# EAGLE design PQ60 EPS FV2 (EAGLE 7.4.0)
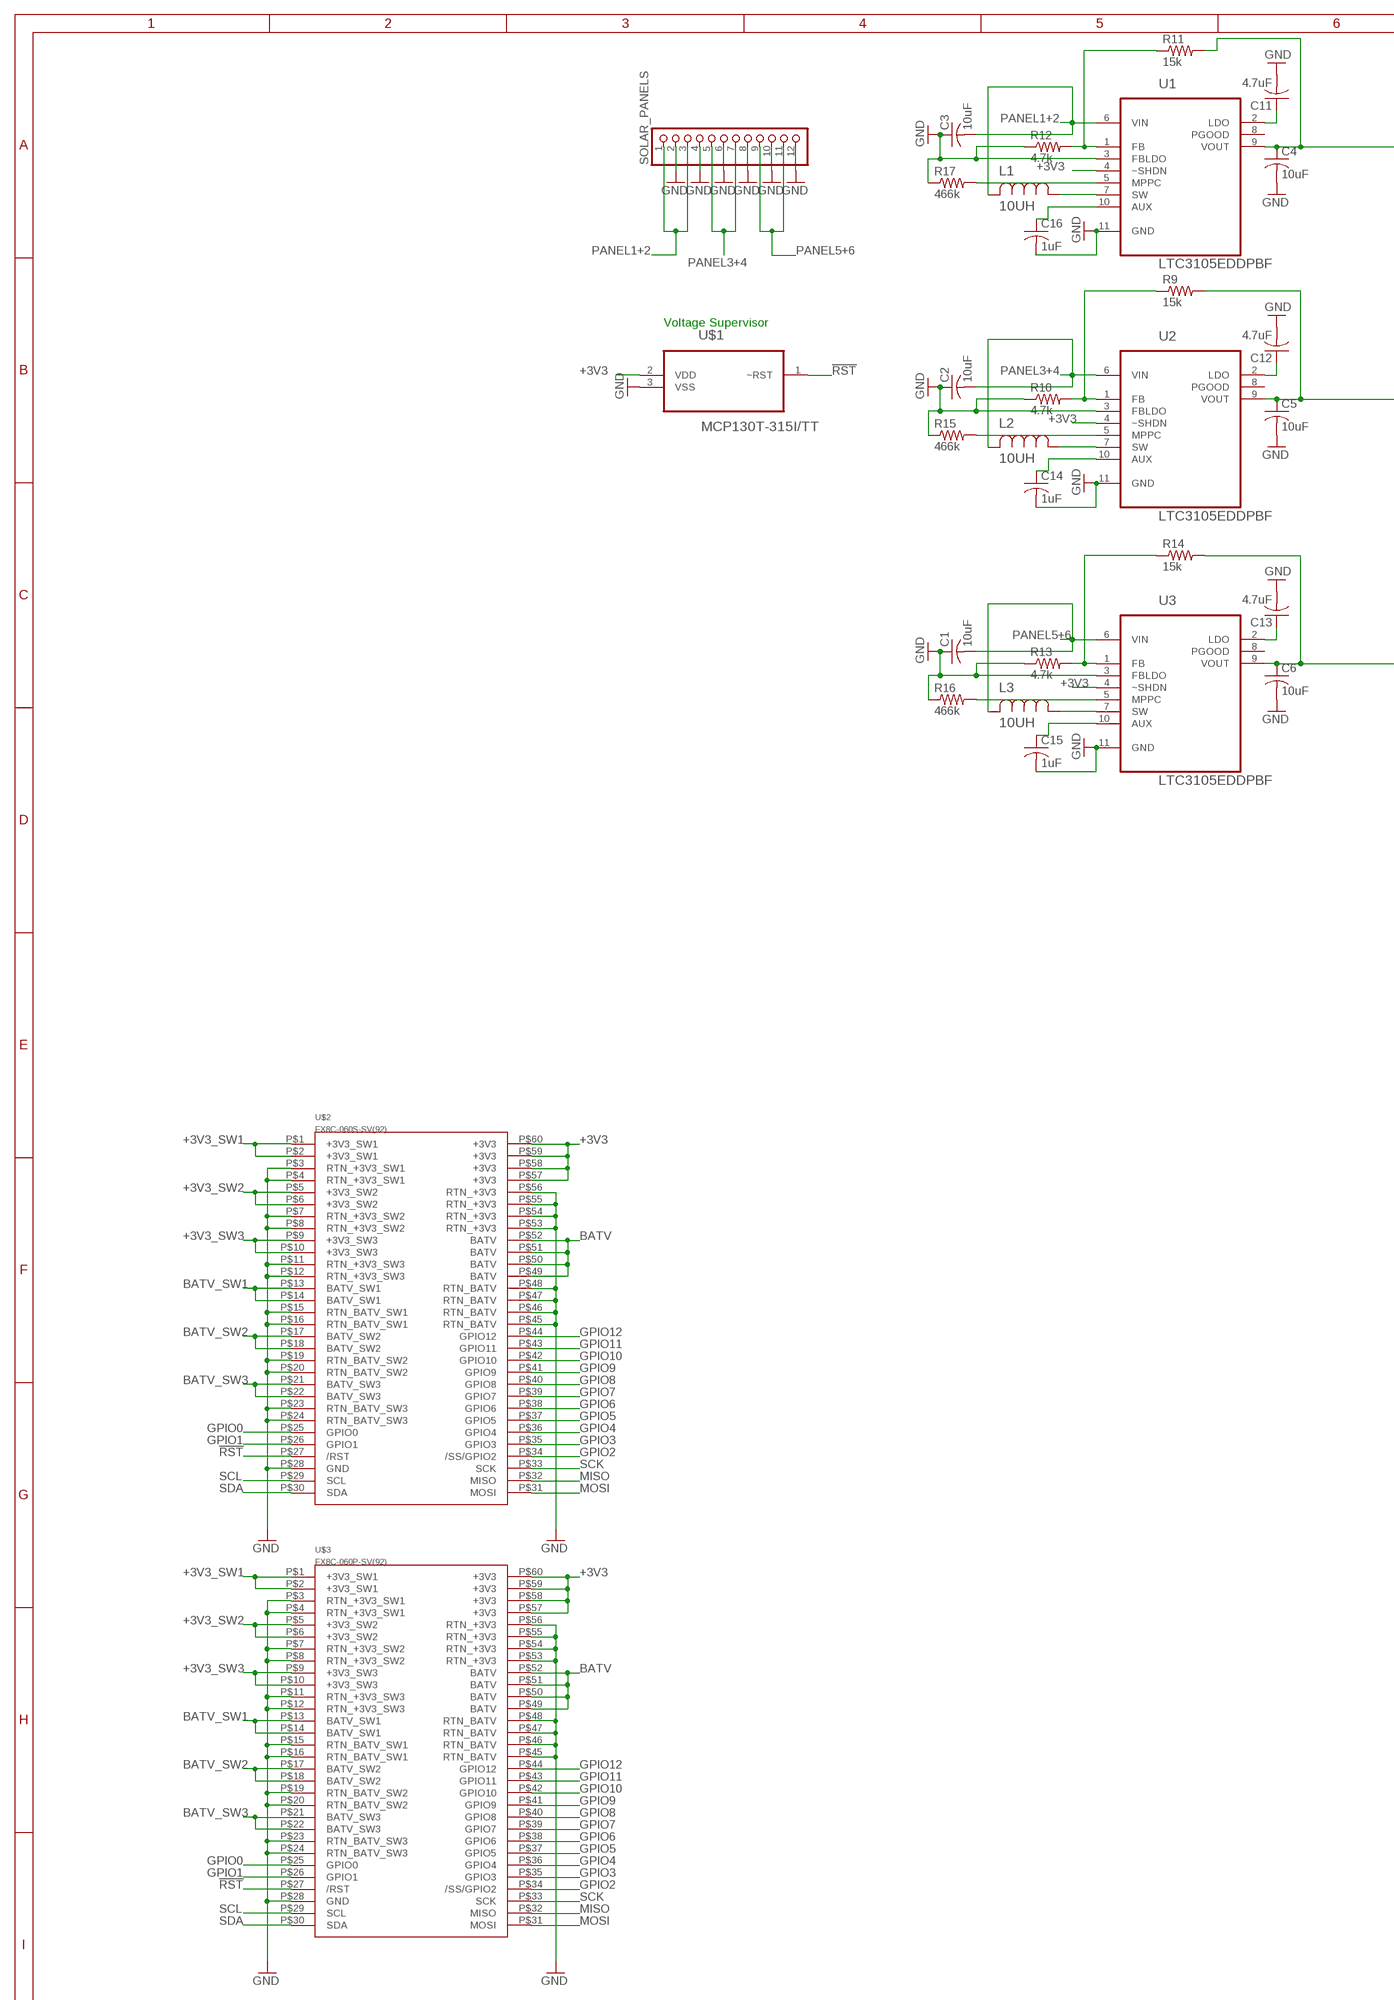
[diagram p0: schematic, sheet 1, part 1 of 2]
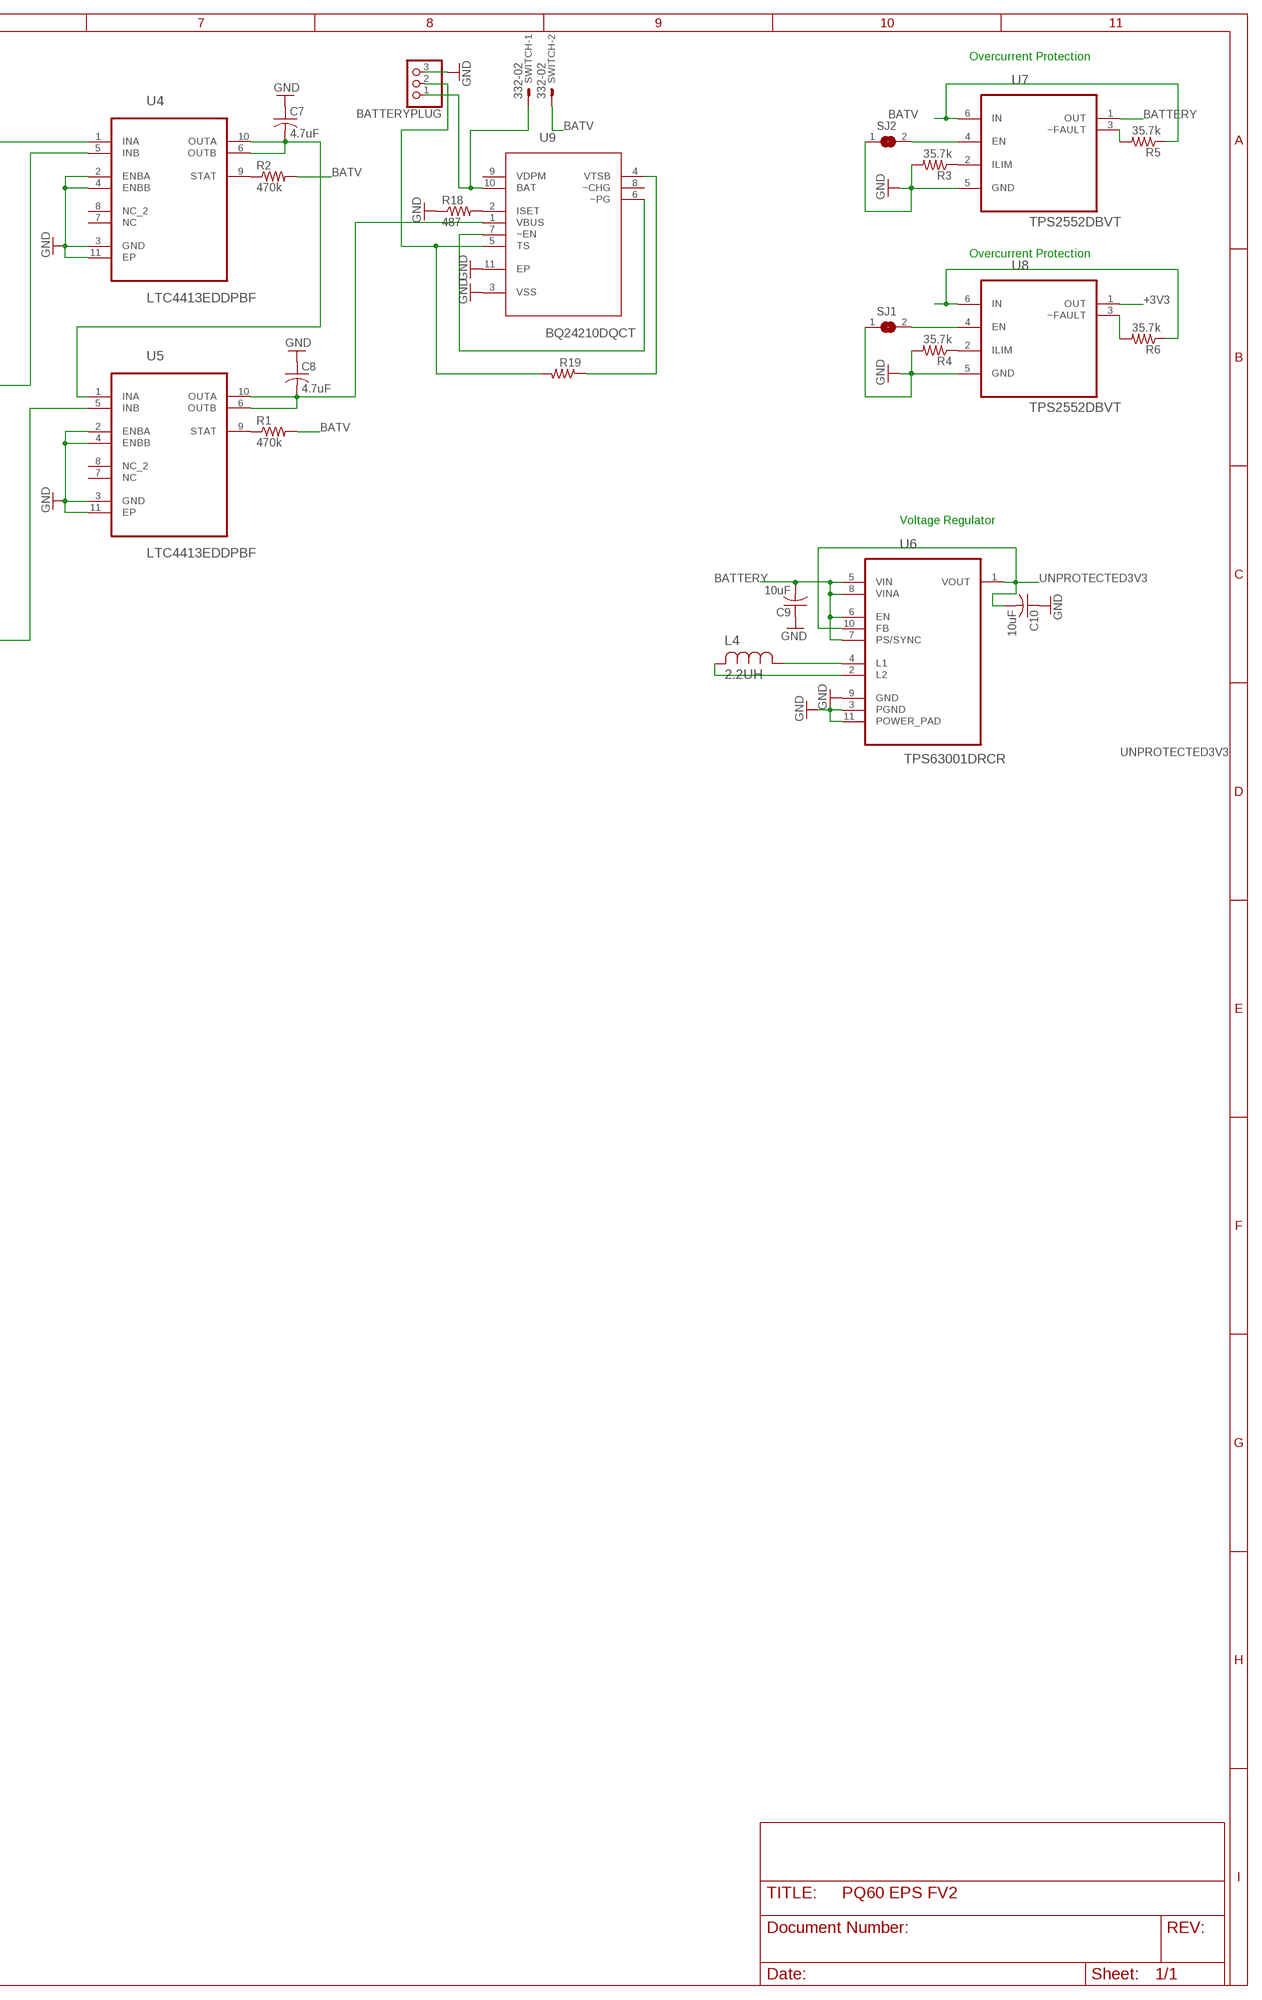
[diagram p1: schematic, sheet 1, part 2 of 2]

## Parts
BATTERYPLUG  PINHD-1X3  [1X03]
C1  10uF  C-USC0805  [C0805]
C2  10uF  C-USC0805  [C0805]
C3  10uF  C-USC0805  [C0805]
C4  10uF  C-USC0805  [C0805]
C5  10uF  C-USC0805  [C0805]
C6  10uF  C-USC0805  [C0805]
C7  4.7uF  C-USC0805  [C0805]
C8  4.7uF  C-USC0805  [C0805]
C9  10uF  C-USC0805  [C0805]
C10  10uF  C-USC0805  [C0805]
C11  4.7uF  C-USC0805  [C0805]
C12  4.7uF  C-USC0805  [C0805]
C13  4.7uF  C-USC0805  [C0805]
C14  1uF  C-USC0805  [C0805]
C15  1uF  C-USC0805  [C0805]
C16  1uF  C-USC0805  [C0805]
L1  10UH  ELL6SH100M-6XH  [IND_ELL6XH]
L2  10UH  ELL6SH100M-6XH  [IND_ELL6XH]
L3  10UH  ELL6SH100M-6XH  [IND_ELL6XH]
L4  2.2UH  ELL3FU2R2N-3FU  [IND_ELL3FU]
R1  470k  R-US_R0805  [R0805]
R2  470k  R-US_R0805  [R0805]
R3  35.7k  R-US_R0805  [R0805]
R4  35.7k  R-US_R0805  [R0805]
R5  35.7k  R-US_R0805  [R0805]
R6  35.7k  R-US_R0805  [R0805]
R9  15k  R-US_R0805  [R0805]
R10  4.7k  R-US_R0805  [R0805]
R11  15k  R-US_R0805  [R0805]
R12  4.7k  R-US_R0805  [R0805]
R13  4.7k  R-US_R0805  [R0805]
R14  15k  R-US_R0805  [R0805]
R15  466k  R-US_R0805  [R0805]
R16  466k  R-US_R0805  [R0805]
R17  466k  R-US_R0805  [R0805]
R18  487  R-US_R0805  [R0805]
R19  R-US_R0805  [R0805]
SJ1  SJ  [SJ]
SJ2  SJ  [SJ]
SOLAR_PANELS  PINHD-1X12-CB  [1X12-CB]
SWITCH  332-02  [332-02]
U1  LTC3105EDDPBF  [DFN300X300X80-11N]
U2  LTC3105EDDPBF  [DFN300X300X80-11N]
U3  LTC3105EDDPBF  [DFN300X300X80-11N]
U4  LTC4413EDDPBF  [DFN300X300X80-11N]
U5  LTC4413EDDPBF  [DFN300X300X80-11N]
U6  TPS63001DRCR  [SON50P300X300X100-11N]
U7  TPS2552DBVT  [SOT95P280X145-6N]
U8  TPS2552DBVT  [SOT95P280X145-6N]
U9  BQ24210DQCT  [SON50P200X300X80-11N]
U$1  MCP130T-315I/TT  [SOT95P237X112-3N]
U$2  FX8C-060S-SV(92)  [FX8C-060S-SV(92)]
U$3  FX8C-060P-SV(92)  [FX8C-060P-SV(92)]

## Nets
!RST: U$1.1(~RST) U$2.P$27(/RST) U$3.P$27(/RST)
+3V3: U1.4(~SHDN) U2.4(~SHDN) U3.4(~SHDN) U8.1(OUT) U$1.2(VDD) U$2.P$57(+3V3) U$2.P$58(+3V3) U$2.P$59(+3V3) U$2.P$60(+3V3) U$3.P$57(+3V3) U$3.P$58(+3V3) U$3.P$59(+3V3) U$3.P$60(+3V3)
+3V3_SW1: U$2.P$1(+3V3_SW1) U$2.P$2(+3V3_SW1) U$3.P$1(+3V3_SW1) U$3.P$2(+3V3_SW1)
+3V3_SW2: U$2.P$5(+3V3_SW2) U$2.P$6(+3V3_SW2) U$3.P$5(+3V3_SW2) U$3.P$6(+3V3_SW2)
+3V3_SW3: U$2.P$9(+3V3_SW3) U$2.P$10(+3V3_SW3) U$3.P$9(+3V3_SW3) U$3.P$10(+3V3_SW3)
BATTERY: C9.2 U6.5(VIN) U6.6(EN) U6.7(PS/SYNC) U6.8(VINA) U7.1(OUT)
BATV: R1.2 R2.2 R5.1 SWITCH.2 U7.6(IN) U$2.P$49(BATV) U$2.P$50(BATV) U$2.P$51(BATV) U$2.P$52(BATV) U$3.P$49(BATV) U$3.P$50(BATV) U$3.P$51(BATV) U$3.P$52(BATV)
BATV_SW1: U$2.P$13(BATV_SW1) U$2.P$14(BATV_SW1) U$3.P$13(BATV_SW1) U$3.P$14(BATV_SW1)
BATV_SW2: U$2.P$17(BATV_SW2) U$2.P$18(BATV_SW2) U$3.P$17(BATV_SW2) U$3.P$18(BATV_SW2)
BATV_SW3: U$2.P$21(BATV_SW3) U$2.P$22(BATV_SW3) U$3.P$21(BATV_SW3) U$3.P$22(BATV_SW3)
GND: BATTERYPLUG.3 C1.1 C2.1 C3.1 C4.2 C5.2 C6.2 C7.1 C8.1 C9.1 C10.1 C11.2 C12.2 C13.2 C14.2 C15.2 C16.2 R3.2 R4.2 R10.1 R12.1 R13.1 R15.1 R16.1 R17.1 R18.1 SJ1.1 SJ2.1 SOLAR_PANELS.2 SOLAR_PANELS.4 SOLAR_PANELS.6 SOLAR_PANELS.8 SOLAR_PANELS.10 SOLAR_PANELS.12 U1.3(FBLDO) U1.11(GND) U2.3(FBLDO) U2.11(GND) U3.3(FBLDO) U3.11(GND) U4.2(ENBA) U4.3(GND) U4.4(ENBB) U4.11(EP) U5.2(ENBA) U5.3(GND) U5.4(ENBB) U5.11(EP) U6.3(PGND) U6.9(GND) U6.11(POWER_PAD) U7.5(GND) U8.5(GND) U9.3(VSS) U9.11(EP) U$1.3(VSS) U$2.P$3(RTN_+3V3_SW1) U$2.P$4(RTN_+3V3_SW1) U$2.P$7(RTN_+3V3_SW2) U$2.P$8(RTN_+3V3_SW2) U$2.P$11(RTN_+3V3_SW3) U$2.P$12(RTN_+3V3_SW3) U$2.P$15(RTN_BATV_SW1) U$2.P$16(RTN_BATV_SW1) U$2.P$19(RTN_BATV_SW2) U$2.P$20(RTN_BATV_SW2) U$2.P$23(RTN_BATV_SW3) U$2.P$24(RTN_BATV_SW3) U$2.P$28(GND) U$2.P$45(RTN_BATV) U$2.P$46(RTN_BATV) U$2.P$47(RTN_BATV) U$2.P$48(RTN_BATV) U$2.P$53(RTN_+3V3) U$2.P$54(RTN_+3V3) U$2.P$55(RTN_+3V3) U$2.P$56(RTN_+3V3) U$3.P$3(RTN_+3V3_SW1) U$3.P$4(RTN_+3V3_SW1) U$3.P$7(RTN_+3V3_SW2) U$3.P$8(RTN_+3V3_SW2) U$3.P$11(RTN_+3V3_SW3) U$3.P$12(RTN_+3V3_SW3) U$3.P$15(RTN_BATV_SW1) U$3.P$16(RTN_BATV_SW1) U$3.P$19(RTN_BATV_SW2) U$3.P$20(RTN_BATV_SW2) U$3.P$23(RTN_BATV_SW3) U$3.P$24(RTN_BATV_SW3) U$3.P$28(GND) U$3.P$45(RTN_BATV) U$3.P$46(RTN_BATV) U$3.P$47(RTN_BATV) U$3.P$48(RTN_BATV) U$3.P$53(RTN_+3V3) U$3.P$54(RTN_+3V3) U$3.P$55(RTN_+3V3) U$3.P$56(RTN_+3V3)
GPIO0: U$2.P$25(GPIO0) U$3.P$25(GPIO0)
GPIO1: U$2.P$26(GPIO1) U$3.P$26(GPIO1)
GPIO2: U$2.P$34(/SS/GPIO2) U$3.P$34(/SS/GPIO2)
GPIO3: U$2.P$35(GPIO3) U$3.P$35(GPIO3)
GPIO4: U$2.P$36(GPIO4) U$3.P$36(GPIO4)
GPIO5: U$2.P$37(GPIO5) U$3.P$37(GPIO5)
GPIO6: U$2.P$38(GPIO6) U$3.P$38(GPIO6)
GPIO7: U$2.P$39(GPIO7) U$3.P$39(GPIO7)
GPIO8: U$2.P$40(GPIO8) U$3.P$40(GPIO8)
GPIO9: U$2.P$41(GPIO9) U$3.P$41(GPIO9)
GPIO10: U$2.P$42(GPIO10) U$3.P$42(GPIO10)
GPIO11: U$2.P$43(GPIO11) U$3.P$43(GPIO11)
GPIO12: U$2.P$44(GPIO12) U$3.P$44(GPIO12)
MISO: U$2.P$32(MISO) U$3.P$32(MISO)
MOSI: U$2.P$31(MOSI) U$3.P$31(MOSI)
N$1: L2.1 U2.7(SW)
N$2: L3.1 U3.7(SW)
N$3: L1.1 U1.7(SW)
N$4: L4.1 U6.4(L1)
N$5: C4.1 R11.2 U1.9(VOUT) U4.1(INA)
N$6: C5.1 R9.2 U2.9(VOUT) U4.5(INB)
N$7: C6.1 R14.2 U3.9(VOUT) U5.5(INB)
N$8: R4.1 U8.2(ILIM)
N$9: C7.2 U4.6(OUTB) U4.10(OUTA) U5.1(INA)
N$10: R1.1 U5.9(STAT)
N$11: R2.1 U4.9(STAT)
N$12: L4.2 U6.2(L2)
N$13: R3.1 U7.2(ILIM)
N$14: R5.2 U7.3(~FAULT)
N$15: R6.2 U8.3(~FAULT)
N$16: SJ1.2 U8.4(EN)
N$17: SJ2.2 U7.4(EN)
N$18: R13.2 R14.1 U3.1(FB)
N$19: C11.1 U1.2(LDO)
N$20: C12.1 U2.2(LDO)
N$21: C13.1 U3.2(LDO)
N$22: C14.1 U2.10(AUX)
N$23: C15.1 U3.10(AUX)
N$24: C16.1 U1.10(AUX)
N$25: R11.1 R12.2 U1.1(FB)
N$26: R9.1 R10.2 U2.1(FB)
N$28: R15.2 U2.5(MPPC)
N$29: R16.2 U3.5(MPPC)
N$30: R17.2 U1.5(MPPC)
N$31: C8.2 U5.6(OUTB) U5.10(OUTA) U9.1(VBUS)
N$32: U9.6(~PG) U9.7(~EN)
N$33: R18.2 U9.2(ISET)
N$34: BATTERYPLUG.1 SWITCH.1 U9.10(BAT)
N$35: BATTERYPLUG.2 R19.2 U9.5(TS)
N$36: R19.1 U9.4(VTSB)
PANEL1+2: C3.2 L1.2 SOLAR_PANELS.1 SOLAR_PANELS.3 U1.6(VIN)
PANEL3+4: C2.2 L2.2 SOLAR_PANELS.5 SOLAR_PANELS.7 U2.6(VIN)
PANEL5+6: C1.2 L3.2 SOLAR_PANELS.9 SOLAR_PANELS.11 U3.6(VIN)
SCK: U$2.P$33(SCK) U$3.P$33(SCK)
SCL: U$2.P$29(SCL) U$3.P$29(SCL)
SDA: U$2.P$30(SDA) U$3.P$30(SDA)
UNPROTECTED3V3: C10.2 R6.1 U6.1(VOUT) U6.10(FB) U8.6(IN)
Unconnected: U1.8(PGOOD) U2.8(PGOOD) U3.8(PGOOD) U4.7(NC) U4.8(NC_2) U5.7(NC) U5.8(NC_2) U9.8(~CHG) U9.9(VDPM)

## Notes on the sheet
- Overcurrent Protection
- Overcurrent Protection
- Voltage Supervisor
- Voltage Regulator

## Library data of the parts
BATTERYPLUG = adafruit:PINHD-1X3: PIN HEADER
C1-C16 = adafruit:C-US: CAPACITOR, American symbol
L1-L3 = Panasonic-ELL:ELL: Choke Coils; MPN: ELL6SH100M; OC_FARNELL: 1539555; OC_NEWARK: 95M4201; PACKAGE: SMD; SUPPLIER: PANASONIC
L4 = Panasonic-ELL:ELL: Choke Coils; CURRENTRATING: 1.6A; MPN: ELL3FU2R2N; OC_FARNELL: 1888686; OC_NEWARK: 56T0899; PACKAGE: SMD-3FU; SUPPLIER: PANASONIC; TOLERANCE: ±30 %
R1-R6 R9-R19 = adafruit:R-US_: RESISTOR, American symbol
SJ1 SJ2 = jumper:SJ: SMD solder JUMPER
SOLAR_PANELS = adafruit:PINHD-1X12: PIN HEADER
SWITCH = con-garry:332-02: 2 Pin - 2mm Dual Row Source: www.mpe-connector.de / garry_shortform_2012.pdf
U1-U3 = LTC3105:LTC3105EDDPBF: 400mA Step-Up DC/DC Converter with Maximum Power Point Control and 250mV Start-Up; MPN: LTC3105EDD#PBF; OC_FARNELL: 1898600; OC_NEWARK: 27T5809; PACKAGE: DFN-10; SUPPLIER: Linear Technology
U4 U5 = LTC4413:LTC4413EDDPBF: Dual 2.6A, 2.5V to 5.5V, Ideal Diodes; MPN: LTC4413EDD#PBF; OC_FARNELL: 1663736; OC_NEWARK: 56M9529; PACKAGE: DFN-10; SUPPLIER: Linear Technology
U6 = TPS63001:TPS63001DRCR: HIGH EFFICIENT SINGLE INDUCTOR BUCK-BOOST CONVERTER WITH 1.8-A SWITCHES; MPN: TPS63001DRCR; OC_FARNELL: -; OC_NEWARK: 85K1711; PACKAGE: SON-10; SUPPLIER: TEXAS INSTRUMENTS
U7 U8 = TPS2552:TPS2552DBVT: PRECISION ADJUSTABLE CURRENT-LIMITED POWER-DISTRIBUTION SWITCHES; MPN: TPS2552DBVT; OC_FARNELL: 1694421; OC_NEWARK: 40P3866; PACKAGE: SOT-23-6; SUPPLIER: Texas Instruments
U9 = BQ24210:BQ24210DQCT: Single Cell Li-Ion Battery Solar Charger; MPN: BQ24210DQCT; OC_FARNELL: 1903633; OC_NEWARK: 56T0491; PACKAGE: SON-10; SUPPLIER: TEXAS INSTRUMENTS
U$1 = MCP130T:MCP130T-315I/TT: Microcontroller Supervisory Circuit; MPN: MCP130T-315I/TT; OC_FARNELL: 3021154; OC_NEWARK: 96K3703; PACKAGE: SOT-3; SUPPLIER: Microchip
U$2 = PQ60:FX8C-060S-SV(92)
U$3 = PQ60:FX8C-060P-SV(92)

## Net classes
0 default: clearance 0.205 mm

## Board
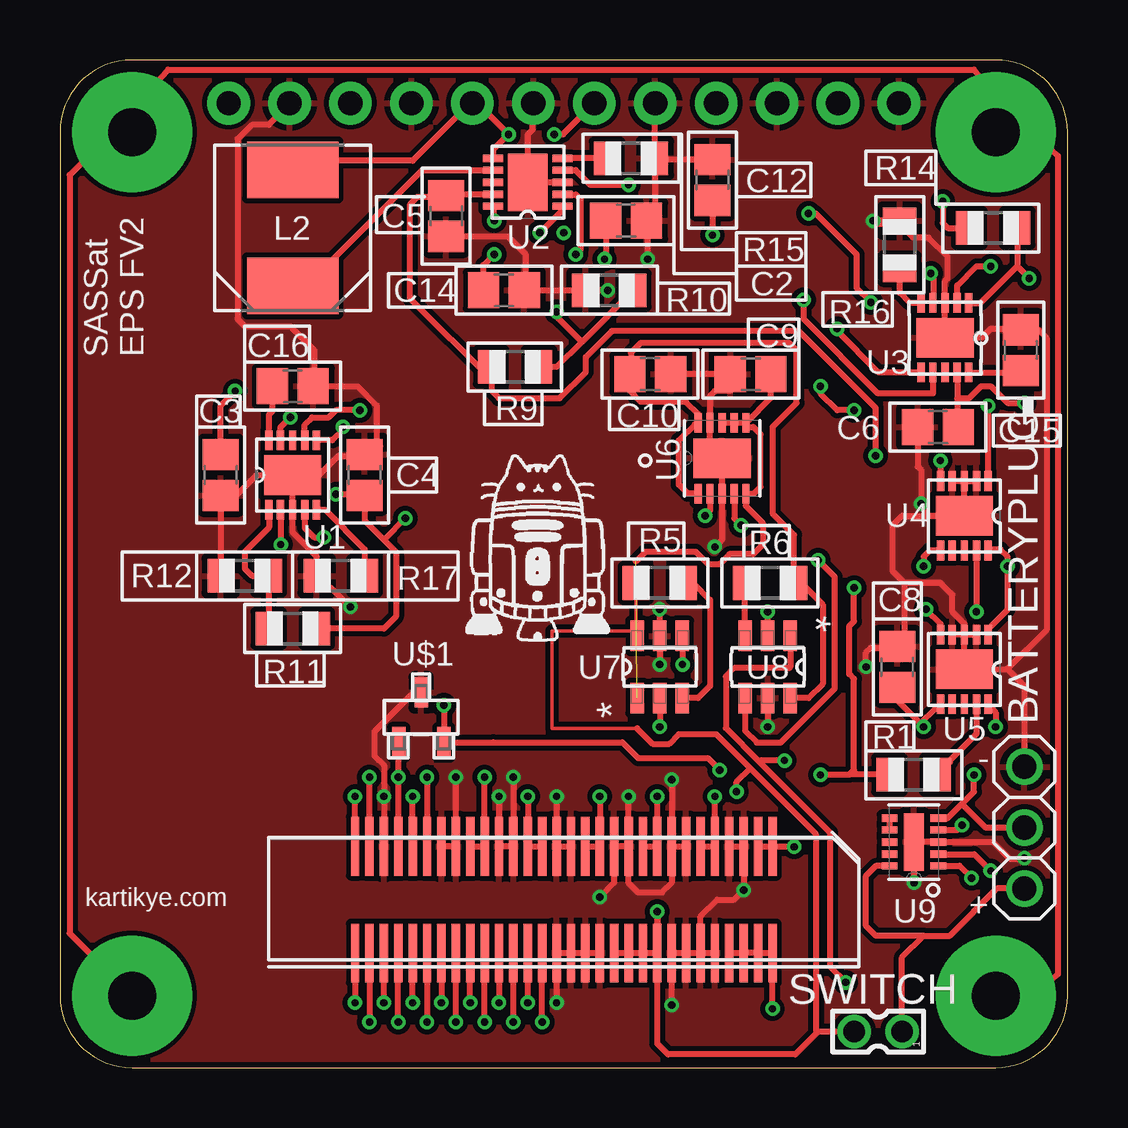
[diagram p2: board, top side]
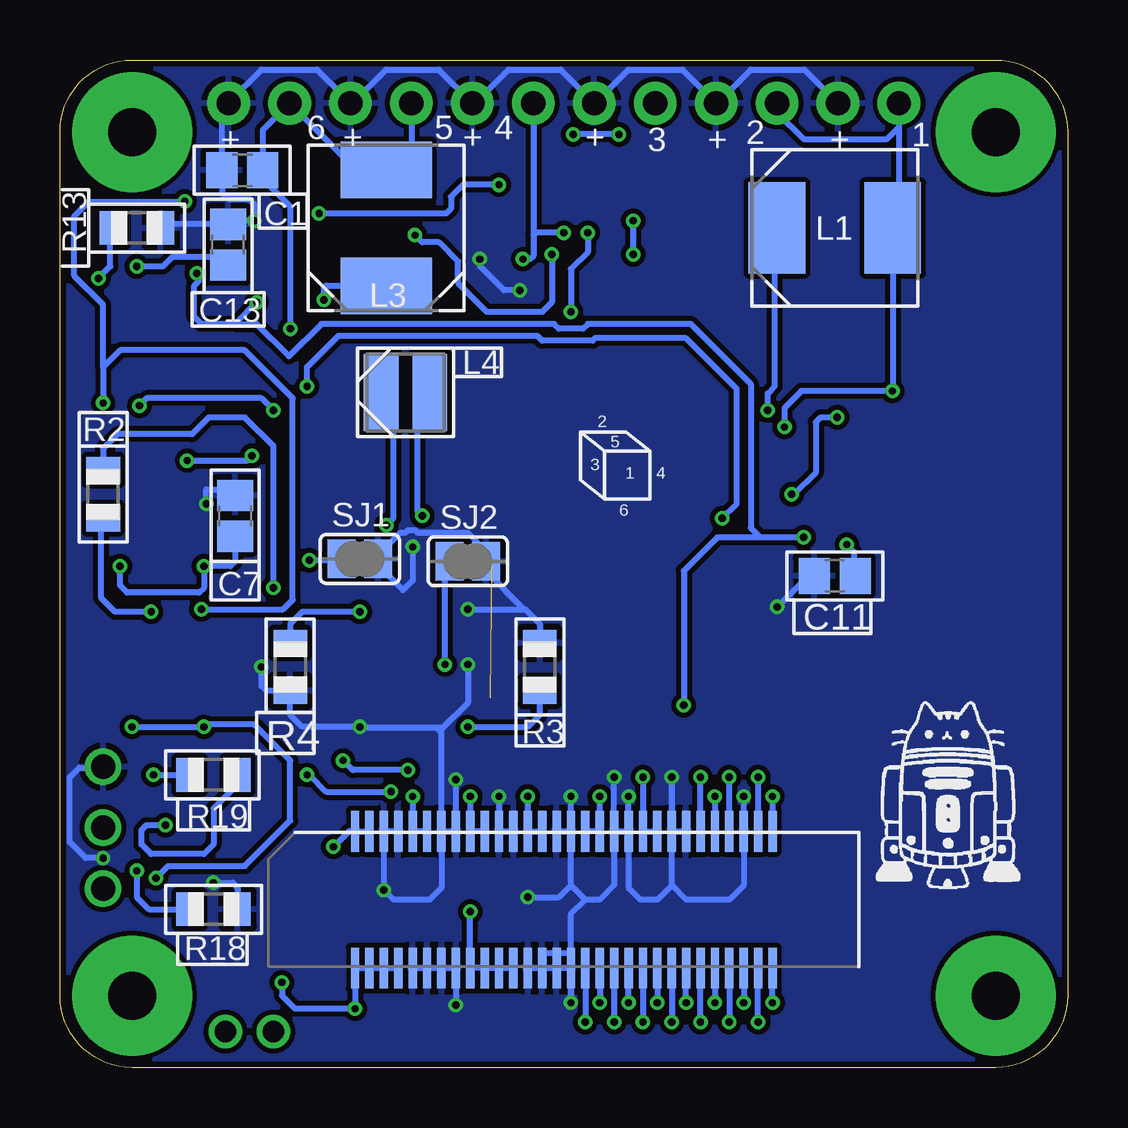
[diagram p3: board, bottom side, seen from below]

Size 42 x 42 mm. Coordinates in mm from the lower left corner, seen from the top.
Outline: 42,3 42,39 arc90 39,42 3,42 arc90 0,39 0,3 arc90 3,0 39,0 arc90 42,3
Copper layers (1*16): Top 0.035mm / dielectric 1.5mm / Bottom 0.035mm
Design rules "SeeedStudio_2layer_DRU_no_angle_20140221 *": minimum track width 6mil, minimum drill 0.3mm, track to track 6mil, track to pad 6mil, pad to pad 6mil, via to via 6mil, smd to smd 0mil, copper to edge 10mil, drill to drill 10mil, minimum pad ring 10mil, minimum via ring 6mil, stop-mask expansion 2mil, vias tented up to drill 100mil, thermal gap 10mil

### Footprints (pad centres in the part's own frame; a part is rotated, then mirrored left to right if it is on the bottom)
1X03 = drill 1.016: 1 -2.54,0; 2 0,0; 3 2.54,0
C0805 = smd 1.3 x 1.5: 1 -0.85,0; 2 0.85,0
IND_ELL6XH = smd 2.362 x 3.81: 1 -2.413,0; 2 2.413,0
IND_ELL3FU = smd 1.448 x 3.2: 1 -1.016,0; 2 1.016,0
R0805 = smd 1.1 x 1.4: 1 -1,0; 2 1,0
SJ = smd 1.168 x 1.6: 1 -0.762,0; 2 0.762,0
1X12-CB = drill 1.016 pad 1.778: 1 -13.97,0; 2 -11.43,0; 3 -8.89,0; 4 -6.35,0; 5 -3.81,0; 6 -1.27,0; 7 1.27,0; 8 3.81,0; 9 6.35,0; 10 8.89,0; 11 11.43,0; 12 13.97,0
332-02 = drill 0.9 pad 1.27: 1 0,-1; 2 0,1
DFN300X300X80-11N = smd 0.813 x 0.305: 1 -1.448,0.991; 2 -1.448,0.508; 3 -1.448,0; 4 -1.448,-0.508; 5 -1.448,-0.991; 6 1.448,-0.991; 7 1.448,-0.508; 8 1.448,0; 9 1.448,0.508; 10 1.448,0.991 | smd 1.651 x 2.388: 11 0,0
SON50P300X300X100-11N = smd 0.813 x 0.305: 1 -1.473,0.991; 2 -1.473,0.508; 3 -1.473,0; 4 -1.473,-0.508; 5 -1.473,-0.991; 6 1.473,-0.991; 7 1.473,-0.508; 8 1.473,0; 9 1.473,0.508; 10 1.473,0.991 | smd 1.651 x 2.388: 11 0,0
SOT95P280X145-6N = smd 1.27 x 0.559: 1 -1.295,0.94; 2 -1.295,0; 3 -1.295,-0.94; 4 1.295,-0.94; 5 1.295,0; 6 1.295,0.94
SON50P200X300X80-11N = smd 0.66 x 0.305: 1 -1.016,0.991; 2 -1.016,0.508; 3 -1.016,0; 4 -1.016,-0.508; 5 -1.016,-0.991; 6 1.016,-0.991; 7 1.016,-0.508; 8 1.016,0; 9 1.016,0.508; 10 1.016,0.991 | smd 0.838 x 2.388: 11 0,0
SOT95P237X112-3N = smd 0.559 x 1.27: 1 -0.94,-1.041; 2 0.94,-1.041; 3 0,1.041
FX8C-060S-SV(92) = smd 0.35 x 1.7: P$1 -8.7,2.85; P$2 -8.1,2.85; P$3 -7.5,2.85; P$4 -6.9,2.85; P$5 -6.3,2.85; P$6 -5.7,2.85; P$7 -5.1,2.85; P$8 -4.5,2.85; P$9 -3.9,2.85; P$10 -3.3,2.85; P$11 -2.7,2.85; P$12 -2.1,2.85; P$13 -1.5,2.85; P$14 -0.9,2.85; P$15 -0.3,2.85; P$16 0.3,2.85; P$17 0.9,2.85; P$18 1.5,2.85; P$19 2.1,2.85; P$20 2.7,2.85; P$21 3.3,2.85; P$22 3.9,2.85; P$23 4.5,2.85; P$24 5.1,2.85; P$25 5.7,2.85; P$26 6.3,2.85; P$27 6.9,2.85; P$28 7.5,2.85; P$29 8.1,2.85; P$30 8.7,2.85; P$31 8.7,-2.85; P$32 8.1,-2.85; P$33 7.5,-2.85; P$34 6.9,-2.85; P$35 6.3,-2.85; P$36 5.7,-2.85; P$37 5.1,-2.85; P$38 4.5,-2.85; P$39 3.9,-2.85; P$40 3.3,-2.85; P$41 2.7,-2.85; P$42 2.1,-2.85; P$43 1.5,-2.85; P$44 0.9,-2.85; P$45 0.3,-2.85; P$46 -0.3,-2.85; P$47 -0.9,-2.85; P$48 -1.5,-2.85; P$49 -2.1,-2.85; P$50 -2.7,-2.85; P$51 -3.3,-2.85; P$52 -3.9,-2.85; P$53 -4.5,-2.85; P$54 -5.1,-2.85; P$55 -5.7,-2.85; P$56 -6.3,-2.85; P$57 -6.9,-2.85; P$58 -7.5,-2.85; P$59 -8.1,-2.85; P$60 -8.7,-2.85
FX8C-060P-SV(92) = smd 0.35 x 2.45: P$1 -8.7,-2.225; P$2 -8.1,-2.225; P$3 -7.5,-2.225; P$4 -6.9,-2.225; P$5 -6.3,-2.225; P$6 -5.7,-2.225; P$7 -5.1,-2.225; P$8 -4.5,-2.225; P$9 -3.9,-2.225; P$10 -3.3,-2.225; P$11 -2.7,-2.225; P$12 -2.1,-2.225; P$13 -1.5,-2.225; P$14 -0.9,-2.225; P$15 -0.3,-2.225; P$16 0.3,-2.225; P$17 0.9,-2.225; P$18 1.5,-2.225; P$19 2.1,-2.225; P$20 2.7,-2.225; P$21 3.3,-2.225; P$22 3.9,-2.225; P$23 4.5,-2.225; P$24 5.1,-2.225; P$25 5.7,-2.225; P$26 6.3,-2.225; P$27 6.9,-2.225; P$28 7.5,-2.225; P$29 8.1,-2.225; P$30 8.7,-2.225; P$31 8.7,2.225; P$32 8.1,2.225; P$33 7.5,2.225; P$34 6.9,2.225; P$35 6.3,2.225; P$36 5.7,2.225; P$37 5.1,2.225; P$38 4.5,2.225; P$39 3.9,2.225; P$40 3.3,2.225; P$41 2.7,2.225; P$42 2.1,2.225; P$43 1.5,2.225; P$44 0.9,2.225; P$45 0.3,2.225; P$46 -0.3,2.225; P$47 -0.9,2.225; P$48 -1.5,2.225; P$49 -2.1,2.225; P$50 -2.7,2.225; P$51 -3.3,2.225; P$52 -3.9,2.225; P$53 -4.5,2.225; P$54 -5.1,2.225; P$55 -5.7,2.225; P$56 -6.3,2.225; P$57 -6.9,2.225; P$58 -7.5,2.225; P$59 -8.1,2.225; P$60 -8.7,2.225

### Placement (x,y rotation side)
BATTERYPLUG  40.2,10 90 top
C1  34.4,37.4 0 bottom
C2  23.6,35.3 180 top
C3  6.7,24.7 90 top
C4  12.7,24.7 90 top
C5  16.1,35.5 270 top
C6  36.6,26.7 180 top
C7  34.7,23 270 bottom
C8  34.9,16.7 270 top
C9  28.79,28.9 0 top
C10  24.61,28.91 180 top
C11  9.7,20.5 180 bottom
C12  27.2,37 90 top
C13  35,34.3 90 bottom
C14  18.5,32.4 0 top
C15  40.05,29.9 90 top
C16  9.7,28.4 0 top
L1  9.7,35 0 bottom
L2  9.7,35 90 top
L3  28.4,35 90 bottom
L4  27.6,28.13 0 bottom
R1  35.58,12.21 180 top
R2  40.2,23.9 90 bottom
R3  22,16.7 90 bottom
R4  32.4,16.7 270 bottom
R5  25,20.2 0 top
R6  29.6,20.2 180 top
R9  18.97,29.21 180 top
R10  22.9,32.4 0 top
R11  9.7,18.3 0 top
R12  7.7,20.5 0 top
R13  38.8,35 180 bottom
R14  38.9,35 180 top
R15  23.8,37.9 180 top
R16  35,34.3 270 top
R17  11.7,20.5 0 top
R18  35.6,6.6 180 bottom
R19  35.6,12.2 180 bottom
SJ1  29.5,21.2 180 bottom
SJ2  25,21.1 180 bottom
SOLAR_PANELS  21,40.2 0 top
SWITCH  34.1,1.5 90 top
U1  9.7,24.7 90 top
U2  19.5,36.9 180 top
U3  36.89,30.42 270 top
U4  37.7,23 270 top
U5  37.7,16.6 270 top
U6  27.6,25.4 90 top
U7  25,16.7 90 top
U8  29.5,16.7 270 top
U9  35.6,9.4 180 top
U$1  15.06,14.6 0 top
U$2  21,7 0 bottom
U$3  21,7 180 top

### Tracks (layer width: path | path; a pad name or v marks a point on that pad's centre or on a via)
!RST  (via drill 0.3)
  Top 0.254: U$3.P$27 v14.1,12.1 U$1.1
  Bottom 0.254: U$2.P$27 v14.1,12.1
+3V3  (via drill 0.3)
  Top 0.254: U$3.P$57 U$3.P$58 U$3.P$59 U$3.P$60 v29.7,2.45 | U8.1 30.44,16.69 30.4,16.65 28.1,16.65 27.75,16.3 27.75,14.15 29.15,12.75 | 29.15,12.75 32.1,9.8 32.1,4.2 v32.75,3.55 | U$1.2 18.06,13.56 | v30.2,12.8 29.2,12.8 29.15,12.75 | 27.3,12.6 v27.5,12.4 27,12.9 24.1,12.9 23.44,13.56 U$1.2 | v16,15.1 U$1.2 | U$1.2 | U2.4 21.49,37.41 22.1,36.8 v23.7,36.8 | v31.2,35.6 31.5,35.6 33.2,33.9 33.2,32.5 v33.8,31.9 | U3.4 36.4,31.89 36.4,32.9 v36.3,33.1 | U1.4 10.21,22.51 10.2,22.5 10.6,22.1 v11,22.1
  Bottom 0.254: U$2.P$60 U$2.P$59 U$2.P$58 U$2.P$57 | v32.75,3.55 32.75,3 32.2,2.45 v29.7,2.45 U$2.P$60 | U$2.P$60 U$3.P$60 | v27.5,12.4 29.8,12.4 v30.2,12.8 | v11,22.1 12.8,22.1 | 12.8,22.1 14.6,22.1 16,20.7 v16,15.1 | v23.7,36.8 25.2,36.8 25.7,36.3 25.7,35.8 25.9,35.6 v31.2,35.6 | v33.8,31.9 34.7,31 | 34.7,31 36.1,31 36.4,31.3 36.4,32.6 36.2,32.8 v36.3,33.1 | 34.7,31 33.8,31 32.45,29.65 31.1,31 21.4,31 21.2,30.8 20.2,30.8 20,31 15.7,31 13.2,28.5 13.2,22.5 12.8,22.1
+3V3_SW1  (via drill 0.3)
  Top 0.254: v30.6,9.2 29.73,9.2 U$3.P$1 U$3.P$2
  Bottom 0.254: U$2.P$2 U$2.P$1 29.95,9.85 v30.6,9.2
+3V3_SW2  (via drill 0.3)
  Top 0.254: U$3.P$6 U$3.P$5 v27.3,11.3
  Bottom 0.254: U$2.P$6 U$2.P$5 v27.3,11.3
+3V3_SW3  (via drill 0.3)
  Top 0.254: U$3.P$10 U$3.P$9 v24.9,11.3
  Bottom 0.254: U$2.P$10 U$2.P$9 | v24.9,11.3 U$2.P$9 | 24.9,9.1 U$2.P$9
BATTERY  (1 unrouted)
  Top 0.254: U6.6 U6.7 U6.8 | U6.6 29.64,27.92 C9.2 | U6.6 28.59,26.81 28.7,26.7 28.9,26.7 29.2,26.4 29.2,24.2 28.93,23.93 U6.5 28.59,23.41 29.3,22.7 29.3,21.8 28.9,21.4 27.9,21.4 27.5,21 27,21 26.5,21.5 24.4,21.5 24,21.1
BATV  (via drill 0.3)
  Top 0.15: 24.06,14.14 20.5,14.14 20.5,18.2 24.06,18.2 U7.6 24,18 R5.1
  Top 0.254: U$3.P$49 U$3.P$50 U$3.P$51 U$3.P$52 | 28.77,12.47 31.5,9.75 31.5,1.4 | 31.5,1.4 30.65,0.55 25.35,0.55 24.9,1 v24.9,6.5 U$3.P$52 | 24.85,4.72 U$3.P$52 | R1.2 32.91,12.21 | v31.7,12.2 v31.71,12.21 32.91,12.21 | v28.2,11.5 28.2,11.9 28.77,12.47 | SWITCH.2 31.6,1.5 31.5,1.4 | 32.91,12.21 33.1,12.4 33.1,16.2 32.9,16.4 32.9,18.4 33.1,18.6 v33.1,20 | 28.77,12.47 27.35,13.9 25.8,13.9 25.4,13.5 24.7,13.5 24.06,14.14
  Bottom 0.254: U$2.P$49 U$2.P$50 U$2.P$51 U$2.P$52 v24.9,6.5 | v31.7,12.2 31.6,12.2 30.9,11.5 v28.2,11.5 | R2.2 40.2,25.8 39.6,26.4 36.5,26.4 35.8,27.1 34.3,27.1 33.1,25.9 v33.1,20
BATV_SW1  (via drill 0.3)
  Top 0.254: U$3.P$14 U$3.P$13 v22.5,11.3
  Bottom 0.254: U$2.P$14 U$2.P$13 v22.5,11.3
BATV_SW2  (via drill 0.3)
  Top 0.254: U$3.P$17 U$3.P$18 v19.5,11.3
  Bottom 0.254: U$2.P$17 U$2.P$18 v19.5,11.3
BATV_SW3  (via drill 0.3)
  Top 0.254: U$3.P$22 U$3.P$21 v17.7,12.1
  Bottom 0.254: U$2.P$22 U$2.P$21 v17.7,12.1
CHASSIS_GND  (via drill 2 pad 5)
  Top 0.254: v3,3 0.4,5.6 0.4,37.2 2.2,39 v3,39 3,40 4.5,41.6 38.1,41.6 39,40.6 v39,39 40.5,39 41.6,38 41.6,3.9 40.6,3 v39,3
GND  (via drill 0.3, 0.3 pad 0.45)
  Top 0.254: U$3.P$48 U$3.P$47 U$3.P$46 U$3.P$45 v20.7,2.7 | U$3.P$55 U$3.P$54 U$3.P$53 v25.5,2.6 | U$3.P$55 U$3.P$56 | v25,19.1 U7.5 v25,16.8 | U8.5 v29.5,14.2 | U6.9 27.1,25.7 27.4,25.4 U6.11 U6.3 27.6,22 v27.3,21.7 | U6.9 27.09,27.34 | C10.1 C9.1 27.95,28.2 27.3,28.2 27.1,28 27.1,26.88 U6.9 | U5.3 U5.11 39.48,16.62 | U5.3 U5.4 | U5.3 U5.2 | 39.48,16.62 40.2,15.9 BATTERYPLUG.3 | v35.6,7.7 U9.11 U9.3 38.9,9.4 39.6,8.7 40.17,8.7 v40.2,8.73 | v33.6,16.7 33.6,17.3 33.8,17.5 34.75,17.5 C8.1 35.2,17.85 35.2,20.2 | U4.3 U4.11 36.1,23 | U4.3 U4.2 | U4.3 U4.4 | 35.2,20.2 34.7,20.7 34.7,22.6 35.1,23 36.1,23 | 36.1,23 36.1,23.3 v35.9,23.5 35.9,24.9 35.75,25.05 C6.2 | U5.3 37.7,18.5 37.2,19 37.2,19.7 36.7,20.2 35.2,20.2 | R16.1 v33.9,35.3 34.05,35.15 C13.2 35.55,34.6 36.2,34.6 37,33.8 37,32.9 36.89,32.79 U3.3 U3.11 38.42,30.42 38.8,30.8 40,30.8 C15.2 40.78,30.75 41.13,30.4 41.13,18.24 39.48,16.62 | U1.11 U1.3 9.7,22.3 10.7,21.3 R17.1 11.2,20 11.3,20 v12.1,19.2 | U1.11 10.8,24.7 11.6,25.5 12.65,25.5 C4.2 13.2,26.05 | U1.11 8.2,24.7 7.35,23.85 C3.1 R12.1 | 13.2,26.05 13.2,27.6 12.4,28.4 C16.2 10.6,28.45 10.6,29.9 9.6,30.9 7.7,30.9 7.4,31.2 7.4,38.7 8,39.3 8.7,39.3 9.57,40.17 SOLAR_PANELS.2 | C5.2 18.65,34.65 19.4,33.9 19.4,32.45 C14.2 R10.1 | 22.7,32.4 R10.1 | U2.3 U2.11 19.5,38.9 19.7,39.1 19.7,40.17 SOLAR_PANELS.6 | R10.1 v22.83,32.4 | v24.5,33.7 24.5,35.25 C2.1 24.8,35.65 R15.1 | C12.2 24.85,37.85 R15.1 | R15.1 SOLAR_PANELS.8 | 13.35,25.9 13.2,26.05 | U$3.P$28 v13.5,11.3 13.5,12.6 13.1,13 13.1,14 14.74,15.64 U$1.3 | U$3.P$24 U$3.P$23 v16.5,12.1 | v18.3,11.3 U$3.P$20 U$3.P$19 v18.9,12.1 | U$3.P$15 U$3.P$16 v20.7,11.3
  Top 0.254: U$3.P$11 U$3.P$12 23.1,7.7 v22.5,7.1 | U$3.P$8 U$3.P$7 | U$3.P$11 v23.7,11.3 | U$3.P$4 U$3.P$3 v28.5,7.4 28.1,7 27.4,7 26.7,6.3 U$3.P$55 | v25.5,12 U$3.P$8 | U$3.P$8 25.5,7.7 25.1,7.3 24.1,7.3 23.7,7.7 U$3.P$11
  Bottom 0.254: U$2.P$24 U$2.P$23 v16.5,12.1 16.5,7.6 | U$2.P$19 U$2.P$20 | U$2.P$15 U$2.P$16 | U$2.P$12 U$2.P$11 v23.7,11.3 | U$2.P$7 U$2.P$8 v25.5,12 | U$2.P$4 U$2.P$3 v28.5,7.4 28.1,7 26.6,7 26.1,7.5 U$2.P$7 | U$2.P$48 U$2.P$47 U$2.P$46 U$2.P$45 v20.7,2.7 U$3.P$45 | U$2.P$56 U$2.P$55 U$2.P$54 U$2.P$53 v25.5,2.6 | v25,19.1 22.65,19.1 | 22.65,19.1 22.6,19.1 22,18.5 R3.2 | 22.65,19.1 24.24,20.69 SJ2.1 24.45,21.31 24.45,21.75 25,22.3 27.1,22.3 27.2,22.4 27.5,22.4 27.6,22.3 27.8,22.3 28.64,21.46 28.74,21.46 SJ1.1 28.74,20.94 27.7,19.9 27.3,20.3 v27.3,21.7 | v25,16.8 25,15.2 26.05,14.15 26.3,14.15 | 26.3,14.15 29.45,14.15 v29.5,14.2 31.9,14.2 32.4,14.7 R4.2 33.4,15.7 33.6,15.9 v33.6,16.7 | U$2.P$7 26.1,13.95 26.3,14.15 | v35.6,7.7 34.8,7.7 34.6,7.5 R18.1 | v35.9,23.5 35.9,24.1 34.95,24.1 C7.1 | SOLAR_PANELS.2 10.97,41.6 13.2,41.6 14.6,40.2 SOLAR_PANELS.4 16.05,41.6 18.3,41.6 19.7,40.2 SOLAR_PANELS.6 21.13,41.6 23.3,41.6 24.7,40.2 SOLAR_PANELS.8 26.21,41.6 28.4,41.6 29.8,40.2 SOLAR_PANELS.10 31.29,41.6 33.6,41.6 34.97,40.23 SOLAR_PANELS.12 35.25,39.92 C1.1 35.25,36.45 35,36.2 34.1,36.2 33.9,36 v33.9,35.3 34.85,35.3 C13.2 37.65,35.15 R13.1 | v22.83,32.4 23.5,32.4 24.5,33.4 v24.5,33.7 | BATTERYPLUG.3 40.24,12.5 41.2,12.5 41.6,12.1 41.6,9.4 40.93,8.73 v40.2,8.73 | v13.5,11.3 U$2.P$28 13.5,7.6 14.1,7 15.9,7 16.5,7.6 | U$2.P$20 v18.3,11.3 | U$2.P$19 v18.9,12.1 | U$2.P$20 18.3,7.5 17.8,7 17.1,7 16.5,7.6 | U$2.P$19 18.9,7.6 19.5,7 20.1,7 | 20.7,7.6 U$2.P$16 | U$2.P$16 v20.7,11.3 | 20.1,7 20.7,7.6 | U$3.P$47 U$3.P$45 | U$3.P$45 20.7,6.4 20.1,7 | v22.5,7.1 21.2,7.1 20.7,7.6 | C11.2 10.8,20.5 v12.1,19.2
  pour Top: 39.1,42 3.1,42 arc90 0,38.9 0,3.3 arc90 3.3,0 38.8,0 arc90 42,3.2 42,39.1 arc90
  pour Bottom: 25.8,42 3.1,42 arc90 0,38.9 0,3.1 arc90 3.2,-0.1 38.8,-0.1 arc90 42,3.1 42,39.1 arc90 39.1,42 26.1,42
GPIO0  (via drill 0.3)
  Top 0.254: v15.3,12.1 U$3.P$25
  Bottom 0.254: U$2.P$25 v15.3,12.1
GPIO1  (via drill 0.3)
  Top 0.254: U$3.P$26 v14.7,11.3
  Bottom 0.254: v14.7,11.3 U$2.P$26
GPIO2  (via drill 0.3)
  Top 0.254: v14.1,1.9 U$3.P$34
  Bottom 0.254: U$2.P$34 v14.1,1.9
GPIO3  (via drill 0.3)
  Top 0.254: v14.7,2.7 U$3.P$35
  Bottom 0.254: U$2.P$35 v14.7,2.7
GPIO4  (via drill 0.3)
  Top 0.254: U$3.P$36 v15.3,1.9
  Bottom 0.254: v15.3,1.9 U$2.P$36
GPIO5  (via drill 0.3)
  Top 0.254: U$3.P$37 v15.9,2.7
  Bottom 0.254: v15.9,2.7 U$2.P$37
GPIO6  (via drill 0.3)
  Top 0.254: v16.5,1.9 U$3.P$38
  Bottom 0.254: U$2.P$38 v16.5,1.9
GPIO7  (via drill 0.3)
  Top 0.254: v17.1,2.7 U$3.P$39
  Bottom 0.254: U$2.P$39 v17.1,2.7
GPIO8  (via drill 0.3)
  Top 0.254: v17.7,1.9 U$3.P$40
  Bottom 0.254: U$2.P$40 v17.7,1.9
GPIO9  (via drill 0.3)
  Top 0.254: U$3.P$41 v18.3,2.7
  Bottom 0.254: v18.3,2.7 U$2.P$41
GPIO10  (via drill 0.3)
  Top 0.254: v18.9,1.9 U$3.P$42
  Bottom 0.254: U$2.P$42 v18.9,1.9
GPIO11  (via drill 0.3)
  Top 0.254: v19.5,2.7 U$3.P$43
  Bottom 0.254: U$2.P$43 v19.5,2.7
GPIO12  (via drill 0.3)
  Top 0.254: v20.1,1.9 U$3.P$44
  Bottom 0.254: U$2.P$44 v20.1,1.9
MISO  (via drill 0.3)
  Top 0.254: U$3.P$32 v12.9,1.9
  Bottom 0.254: v12.9,1.9 U$2.P$32
MOSI  (via drill 0.3)
  Top 0.254: U$3.P$31 v12.3,2.7
  Bottom 0.254: v12.3,2.7 U$2.P$31
N$1
  Top 0.254: U2.7 15.1,37.4 10.29,32.59 L2.1
N$2  (via drill 0.3)
  Top 0.254: U3.7 36.38,28.12 36.4,28.1 34.1,28.1 31,31.2 v31,32
  Bottom 0.254: v31,32 31,32.5 30.9,32.6 28.47,32.6 L3.1
N$3  (via drill 0.3)
  Top 0.254: v12.5,27.4 11.5,27.4 11.2,27.1 10.5,27.1 10.2,26.8 U1.7
  Bottom 0.254: v12.5,27.4 12.5,28.1 12.2,28.4 12.2,34.91 L1.1
N$4  (via drill 0.3)
  Top 0.254: U6.4 28.11,22.89 v28.4,22.6
  Bottom 0.254: v28.4,22.6 28.1,22.9 28.1,27.61 L4.1
N$5  (via drill 0.3)
  Top 0.254: U4.1 v38.69,27.59 v38.7,27.6 | 13.5,22 12.7,22.8 C4.1 12.65,23.9 v11.5,23.9 | 13.5,22 14,21.5 14,18.8 13.5,18.3 R11.2 | U1.9 9.19,26.69 v9.6,27.1 | v33.1,27.4 32.4,27.4 31.7,28.1 v31.7,28.4 | v14.4,22.9 13.5,22
  Bottom 0.254: v38.69,27.59 38.38,27.9 33.6,27.9 v33.1,27.4 | v14.4,22.9 13.8,23.5 13.8,28.3 15.9,30.4 19.7,30.4 19.8,30.3 21.9,30.3 22.1,30.5 30.4,30.5 31.7,29.2 v31.7,28.4 | v9.6,27.1 10.3,27.1 10.5,26.9 10.5,24.8 11.4,23.9 v11.5,23.9
N$6  (via drill 0.3)
  Top 0.254: v34,25.5 34,27.5 30.8,30.7 23,30.7 21.92,29.62 21.92,28.99 20.83,27.9 18.3,27.9 18,28.2 18,28.66 | U4.5 v36.71,25.29 v36.7,25.3 | U2.9 16.14,36.39 C5.1 16.05,36.3 14.9,36.3 14.6,36 14.6,32.06 18,28.66 | 17.69,29.21 R9.2 18,29.18 18,28.66
  Bottom 0.254: v36.7,25.3 34.2,25.3 v34,25.5
N$7  (via drill 0.3)
  Top 0.254: C6.1 37.4,26.75 U3.9 37.4,27.9 37.9,27.9 38.4,28.4 38.8,28.4 39.5,27.7 v40.2,27.7 | U5.5 36.71,18.49 v36.1,19.1 | v36.8,36.1 36.8,35.2 37,35 R14.2
  Bottom 0.254: 40.2,29.2 40.2,31.8 41.4,33 41.4,35.5 40.8,36.1 v36.8,36.1 | v36.1,19.1 32.7,19.1 32.3,19.5 32.3,27.9 34.3,29.9 39.5,29.9 40.2,29.2 | 40.2,29.2 v40.2,27.7
N$8  (via drill 0.3)
  Top 0.254: U8.2 v29.5,19
  Bottom 0.254: v29.5,19 31.9,19 32.4,18.5 R4.1
N$9  (via drill 0.3)
  Top 0.254: U4.6 36.25,21.55 36,21.3 v36,20.9 | U4.10 38.74,21.6 39.2,21.6 39.5,21.3 v39.5,20.9 39.5,19.1 38.69,18.29 U5.1
  Bottom 0.254: C7.2 34.7,21.1 34.9,20.9 v36,20.9 36,20 36.2,19.8 39.2,19.8 39.5,20.1 v39.5,20.9
N$10
  Top 0.254: R1.1 37.1,12.73 37.1,12.8 38.21,13.91 U5.9
N$11  (via drill 0.3)
  Top 0.254: U4.9 v38.21,19.01 v38.2,19
  Bottom 0.254: v38.2,19 39.7,19 40.3,19.6 40.3,22.8 R2.1 40.1,22.8
N$12  (via drill 0.3)
  Top 0.254: U6.2 27.09,23.19 v26.9,23
  Bottom 0.254: v26.9,23 27.1,23.2 27.1,27.61 L4.2
N$13  (via drill 0.3)
  Top 0.254: U7.2 v25,14.2
  Bottom 0.254: v25,14.2 22.5,14.2 22,14.7 R3.1
N$14
  Top 0.254: R5.2 26.4,20.2 27.1,19.5 27.1,15.9 26.6,15.4 U7.3
N$15
  Top 0.254: U8.3 28.56,20.16 R6.2
N$16  (via drill 0.3)
  Top 0.254: U8.4 28.56,14.04 29.05,13.55 30.05,13.55 32.3,15.8 32.3,20.45 v31.6,21.15
  Bottom 0.254: v31.6,21.15 30.31,21.15 SJ1.2
N$17  (via drill 0.3)
  Top 0.254: U7.4 v25.94,16.81 v25.95,16.8
  Bottom 0.254: v25.95,16.8 25.95,20.91 SJ2.2
N$18  (via drill 0.3)
  Top 0.254: U3.1 38.37,31.87 39.9,33.4 | R14.1 39.9,33.4 | 39.9,33.4 v40.4,32.9
  Bottom 0.254: 40.2,35.4 R13.2 39.9,34.9 39.9,33.4 v40.4,32.9
N$19  (via drill 0.3)
  Top 0.254: U1.2 v9.19,21.81 v9.2,21.8
  Bottom 0.254: v9.2,21.8 8.9,21.5 8.9,20.55 C11.1
N$20  (via drill 0.3)
  Top 0.254: U2.2 21.51,36.39 21.7,36.2 21.7,34.1 v21.5,33.9 | C12.1 v27.2,34.7
  Bottom 0.254: v21.5,33.9 21.5,31.9 21.9,31.5 24.2,31.5 25.4,32.7 25.4,33.6 26.2,34.4 26.9,34.4 v27.2,34.7
N$21  (via drill 0.3)
  Top 0.254: U3.2 37.4,32.6 38.2,33.4 v38.8,33.4
  Bottom 0.254: 35.05,33.4 C13.1 35.35,33.8 37.3,33.8 37.7,33.4 v38.8,33.4
N$22  (via drill 0.3)
  Top 0.254: C14.1 17.65,33.45 v18.1,33.9 | v18.1,35.3 18.1,35.86 U2.10
  Bottom 0.254: v18.1,33.9 v18.1,35.3
N$23
  Top 0.254: U3.10 40.02,28.97 C15.1
N$24
  Top 0.254: C16.1 8.85,27.35 8.7,27.2 U1.10
N$25
  Top 0.254: U1.1 8.71,22.51 7.7,21.5 7.7,20.8 8,20.5 R12.2 R11.1
N$26  (via drill 0.3)
  Top 0.254: R9.1 20.71,29.21 21.75,30.25 | 21.75,30.25 R10.2 | U2.1 20.95,35.75 v20,34.8 | v20.7,31.5 20.7,31.3 21.75,30.25
  Bottom 0.254: v20,34.8 20,34 20.7,33.3 v20.7,31.5
N$28
  Top 0.254: R15.2 U2.5
N$29
  Top 0.254: U3.5 35.43,31.87 35,32.3 R16.2
N$30
  Top 0.254: U1.5 11.05,23.25 12.7,21.6 R17.2
N$31  (via drill 0.3)
  Top 0.254: U5.6 36,14.48 v36,14.2 34.9,15.3 C8.2 | U9.1 37.49,8.41 v38,7.9 | U5.10 38.69,15.11 39,14.8 v39,14.2
  Bottom 0.254: v39,14.2 v36,14.2 35.9,14.3 33.9,14.3 32.4,12.8 32.4,10.3 34.3,8.4 37.5,8.4 v38,7.9
N$32
  Top 0.254: U9.7 U9.6
N$33  (via drill 0.3)
  Top 0.254: U9.2 38.11,8.89 v38.8,8.2
  Bottom 0.254: v38.8,8.2 38.8,7.1 38.3,6.6 R18.2
N$34
  Top 0.254: 36,5.5 34,5.5 33.6,5.9 33.6,8 34,8.4 U9.10 | SWITCH.1 35.1,4.6 36,5.5 | 36,5.5 37.1,5.5 39.06,7.46 BATTERYPLUG.1
N$35  (via drill 0.3)
  Top 0.254: BATTERYPLUG.2 38.6,10 37.6,11 | U9.5 36.99,10.39 37.6,11 | 37.6,11 38.1,11.5 v38.1,12.2
  Bottom 0.254: v38.1,12.2 R19.2
N$36  (via drill 0.3)
  Top 0.254: U9.4 37.4,9.9 v37.6,10.1
  Bottom 0.254: R19.1 34.6,11.8 35.6,10.8 35.6,9.3 36,8.9 38.2,8.9 38.6,9.3 38.6,9.9 38.4,10.1 v37.6,10.1
PANEL1+2  (via drill 0.3)
  Top 0.254: C3.2 6.7,27.6 v7.3,28.2 | v11.8,26.7 11.8,26.6 11.35,26.15 U1.6
  Bottom 0.254: SOLAR_PANELS.1 7.03,39.2 | SOLAR_PANELS.3 12.11,39.81 11,38.7 7.53,38.7 7.03,39.2 | v11.8,26.7 11.8,27.5 11.1,28.2 v7.3,28.2 7.29,28.21 L1.2 7.03,35.26 7.03,39.2
PANEL3+4  (via drill 0.3)
  Top 0.254: v20.6,38.9 20.97,38.9 SOLAR_PANELS.7 | L2.2 10.09,37.8 14.7,37.8 17.1,40.2 SOLAR_PANELS.5 17.4,40.2 v18.7,38.9 18.05,38.25 U2.6 | C2.2 22.75,33.75 | 22.75,33.75 v22.7,33.7 | 22.75,33.75 22.75,33.55 | 20.95,34.85 v21,34.8
  Bottom 0.254: v18.7,38.9 v20.6,38.9 | SOLAR_PANELS.7 22.27,34.7 | 22.27,34.7 22.27,33.83 22.4,33.7 v22.7,33.7 | v21,34.8 22.17,34.8 22.27,34.7
PANEL5+6  (via drill 0.3)
  Top 0.254: v32.4,30.8 32.4,30.7 34.1,29 35.87,29 U3.6
  Bottom 0.254: SOLAR_PANELS.9 27.35,38.54 L3.2 29.6,37.37 SOLAR_PANELS.11 33.55,39.08 C1.2 33.55,37.05 32.4,35.9 v32.4,30.8
SCK  (via drill 0.3)
  Top 0.254: v13.5,2.7 U$3.P$33
  Bottom 0.254: U$2.P$33 v13.5,2.7
SCL  (via drill 0.3)
  Top 0.254: U$3.P$29 v12.9,12.1
  Bottom 0.254: v12.9,12.1 U$2.P$29
SDA  (via drill 0.3)
  Top 0.254: U$3.P$30 v12.3,11.3
  Bottom 0.254: v12.3,11.3 U$2.P$30
UNPROTECTED3V3
  Top 0.254: U8.6 31.2,15.4 31.8,16 31.8,19.3 30.9,20.2 R6.1 30.6,22.2 29.7,23.1 29.7,26.7 30.7,27.7 30.7,29.9 30.4,30.2 24.2,30.2 23.8,29.8 23.8,28.95 C10.2 23.75,28.2 24.2,27.75 26.1,27.75 26.61,27.24 U6.10 26.61,26.81 26.46,26.81 25.8,26.15 25.8,24.3 26.17,23.93 U6.1 26.61,23.99

### Text on the board
tPlace: SASSat / EPS FV2 | kartikye.com
bPlace: 4 | 5 | 6 | 1 | + | 2 | + | 3 | + | + | + | + | 2 | 5 | 4 | 1 | 3 | 6
tNames: - | +